# EAGLE schematic generator (EAGLE 7.3.0)
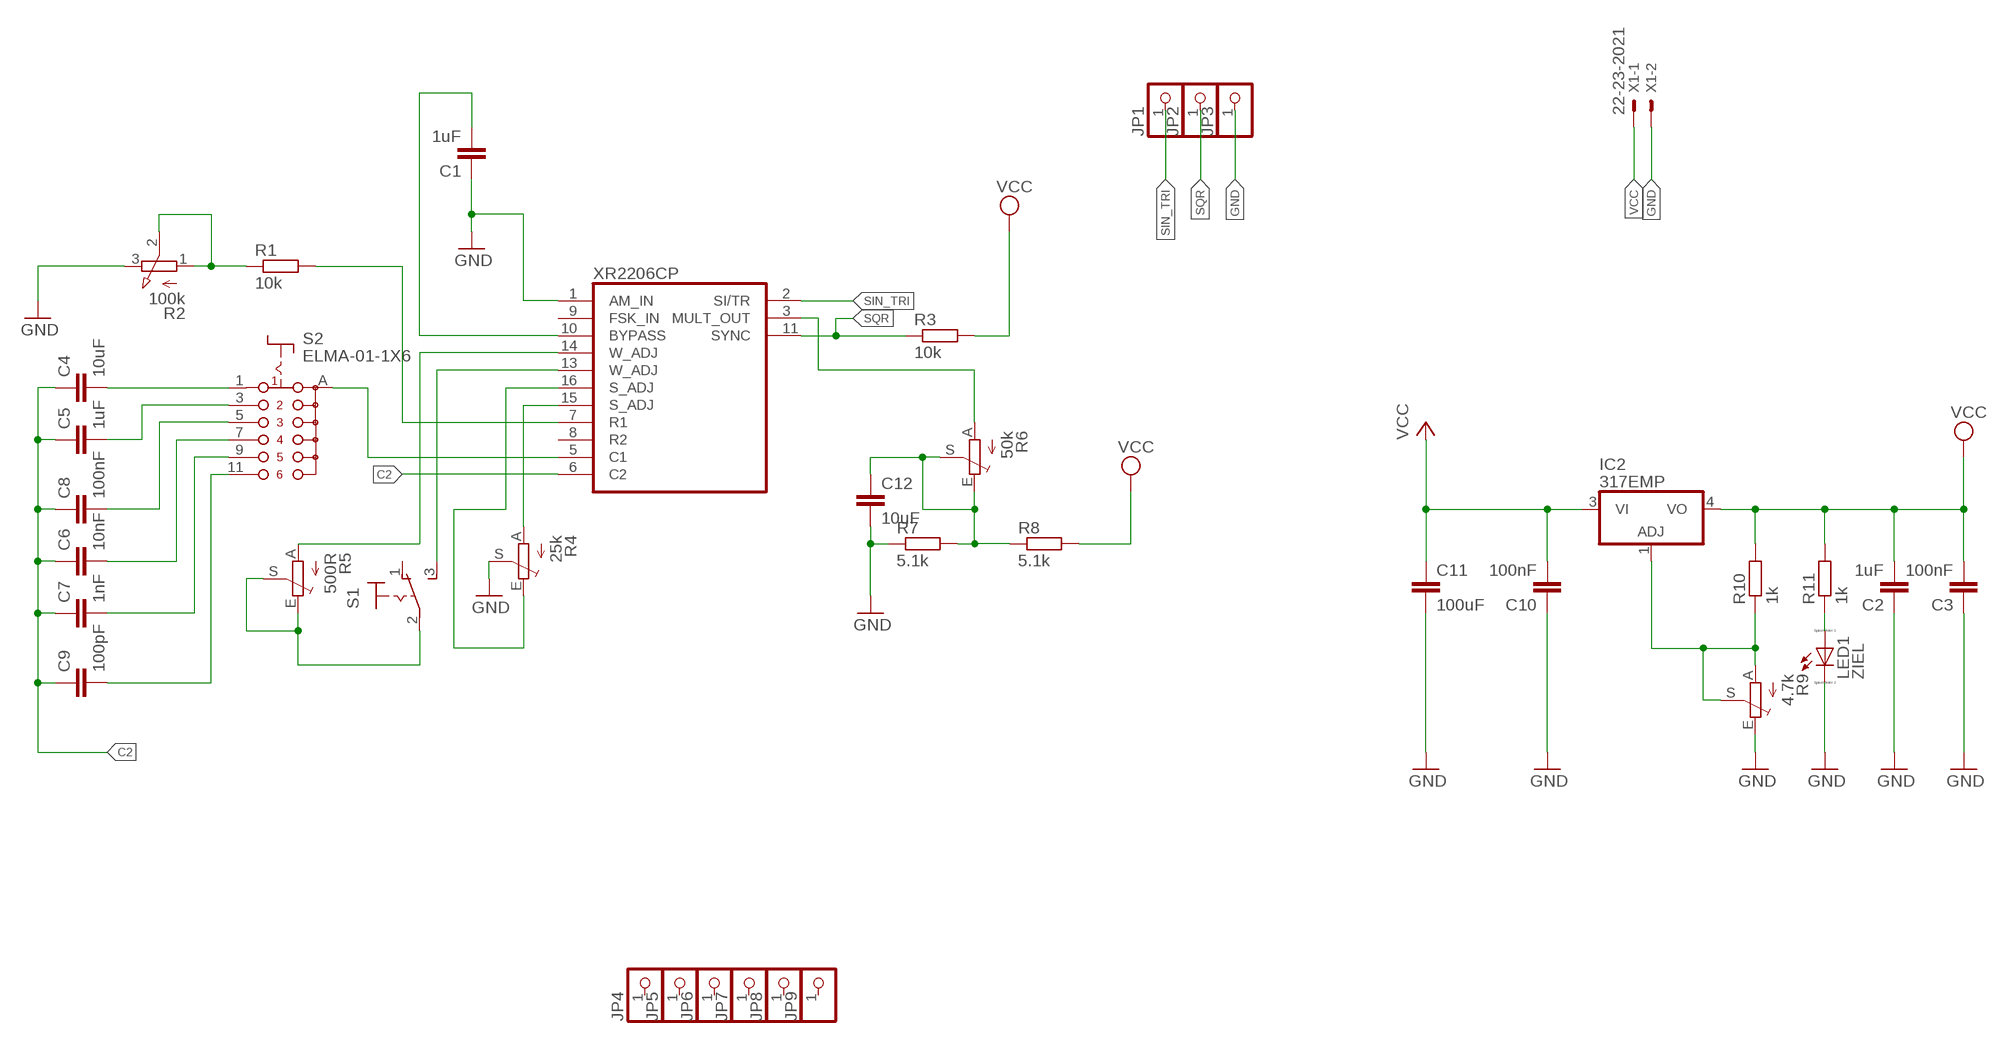
[diagram p0: schematic, sheet 1]

## Parts
C1  1uF  C-EUC0805  [C0805]
C2  1uF  C-EUC0805  [C0805]
C3  100nF  C-EUC0805  [C0805]
C4  10uF  C-EUC0805  [C0805]
C5  1uF  C-EUC0805  [C0805]
C6  10nF  C-EUC0805  [C0805]
C7  1nF  C-EUC0805  [C0805]
C8  100nF  C-EUC0805  [C0805]
C9  100pF  C-EUC0805  [C0805]
C10  100nF  C-EUC0805  [C0805]
C11  100uF  C-EUC0805  [C0805]
C12  10uF  C-EUC0805  [C0805]
IC2  317EMP  [SOT223]
JP1  PINHD-1X1  [1X01]
JP2  PINHD-1X1  [1X01]
JP3  PINHD-1X1  [1X01]
JP4  PINHD-1X1  [1X01]
JP5  PINHD-1X1  [1X01]
JP6  PINHD-1X1  [1X01]
JP7  PINHD-1X1  [1X01]
JP8  PINHD-1X1  [1X01]
JP9  PINHD-1X1  [1X01]
LED1  ZIEL  LED_E  [LED_1206]
R1  10k  R-EU_R0805  [R0805]
R2  100k  3RP/1610N  [3RP/1610N]
R3  10k  R-EU_R0805  [R0805]
R4  25k  TRIM_EU-PTSPIN  [PT-SPIN]
R5  500R  TRIM_EU-PTSPIN  [PT-SPIN]
R6  50k  TRIM_EU-PTSPIN  [PT-SPIN]
R7  5.1k  R-EU_R0805  [R0805]
R8  5.1k  R-EU_R0805  [R0805]
R9  4.7k  TRIM_EU-PTSPIN  [PT-SPIN]
R10  1k  R-EU_R0805  [R0805]
R11  1k  R-EU_R0805  [R0805]
S1  320-916  [320-916]
S2  ELMA-01-1X6  [ELMA-01-1X6]
X1  22-23-2021  [22-23-2021]
XR2206CP  XR-2206  [DIL16]

## Nets
C2: C4.1 C5.1 C6.1 C7.1 C8.1 C9.1 XR2206CP.6(C2)
GND: C1.1 C2.1 C3.1 C10.1 C11.2 C12.2 JP3.1 LED1.C R2.3(E) R4.S R7.1 R9.E X1.2 XR2206CP.1(AM_IN)
N$1: C4.2 S2.1
N$2: S2.A(S) XR2206CP.5(C1)
N$3: C5.2 S2.3
N$4: C8.2 S2.5
N$5: C6.2 S2.7
N$6: C7.2 S2.9
N$7: R1.2 XR2206CP.7(R1)
N$8: C9.2 S2.11
N$9: R1.1 R2.1(A) R2.2(S)
N$10: C1.2 XR2206CP.10(BYPASS)
N$11: C12.1 R6.E R6.S R7.2 R8.1
N$12: R4.A XR2206CP.15(S_ADJ)
N$13: R4.E XR2206CP.16(S_ADJ)
N$14: R5.A XR2206CP.14(W_ADJ)
N$15: S1.3(S) XR2206CP.13(W_ADJ)
N$16: R5.E R5.S S1.2(P)
N$17: R6.A XR2206CP.3(MULT_OUT)
N$18: LED1.A R11.1
N$19: IC2.1(ADJ) R9.A R9.S R10.1
SIN_TRI: JP1.1 XR2206CP.2(SI/TR)
SQR: JP2.1 R3.1 XR2206CP.11(SYNC)
VCC: C2.2 C3.2 C10.2 C11.1 IC2.3(VI) IC2.4(VO) R3.2 R8.2 R10.2 R11.2 X1.1
Unconnected: JP4.1 JP5.1 JP6.1 JP7.1 JP8.1 JP9.1 S1.1(O) XR2206CP.8(R2) XR2206CP.9(FSK_IN)

## Power pins joined to a net without a drawn wire
GND: XR2206CP.12(GND)
VCC: XR2206CP.4(VCC)

## Library data of the parts
C1-C12 = rcl:C-EU: CAPACITOR, European symbol
IC2 = linear:*317: Positive VOLTAGE REGULATOR
JP1-JP9 = pinhead:PINHD-1X1: PIN HEADER
LED1 = eagle-ltspice:LED_E: LED Source: http://www.osram.convergy.de Source: www.luxeon.com Source: www.kingbright.com; SPICEMODEL: NONE; SPICEPREFIX: D; SPICETYPE: diode
R1 R3 R7 R8 R10 R11 = rcl:R-EU_: RESISTOR, European symbol
R2 = pot:3RP/1610N: 16mm Potentiometer one level Source: http://www.alphapotentiometers.net/html/16mm_pot_2.html
R4-R6 R9 = pot:TRIM_EU-: POTENTIOMETER
S1 = switch:320-916: TOGGLE SWITCH distributor RS Components
S2 = switch:ELMA-01-1X6: Rotary Switches Type 01 Source: http://www.elma.com/files/products/rotary_components/pdfs/rotary_switches_type_01_002.pdf
X1 = con-molex:22-23-2021: .100" (2.54mm) Center Header - 2 Pin; MF: MOLEX; MPN: 22-23-2021; OC_FARNELL: 1462926; OC_NEWARK: 25C3832
XR2206CP = exar:XR-2206: Monolithic FUNCTION GENERATOR; OC_FARNELL: unknown; OC_NEWARK: unknown